# EAGLE board ESP32-S3 4G LTE CAT1 V1.1 (EAGLE 6.1)
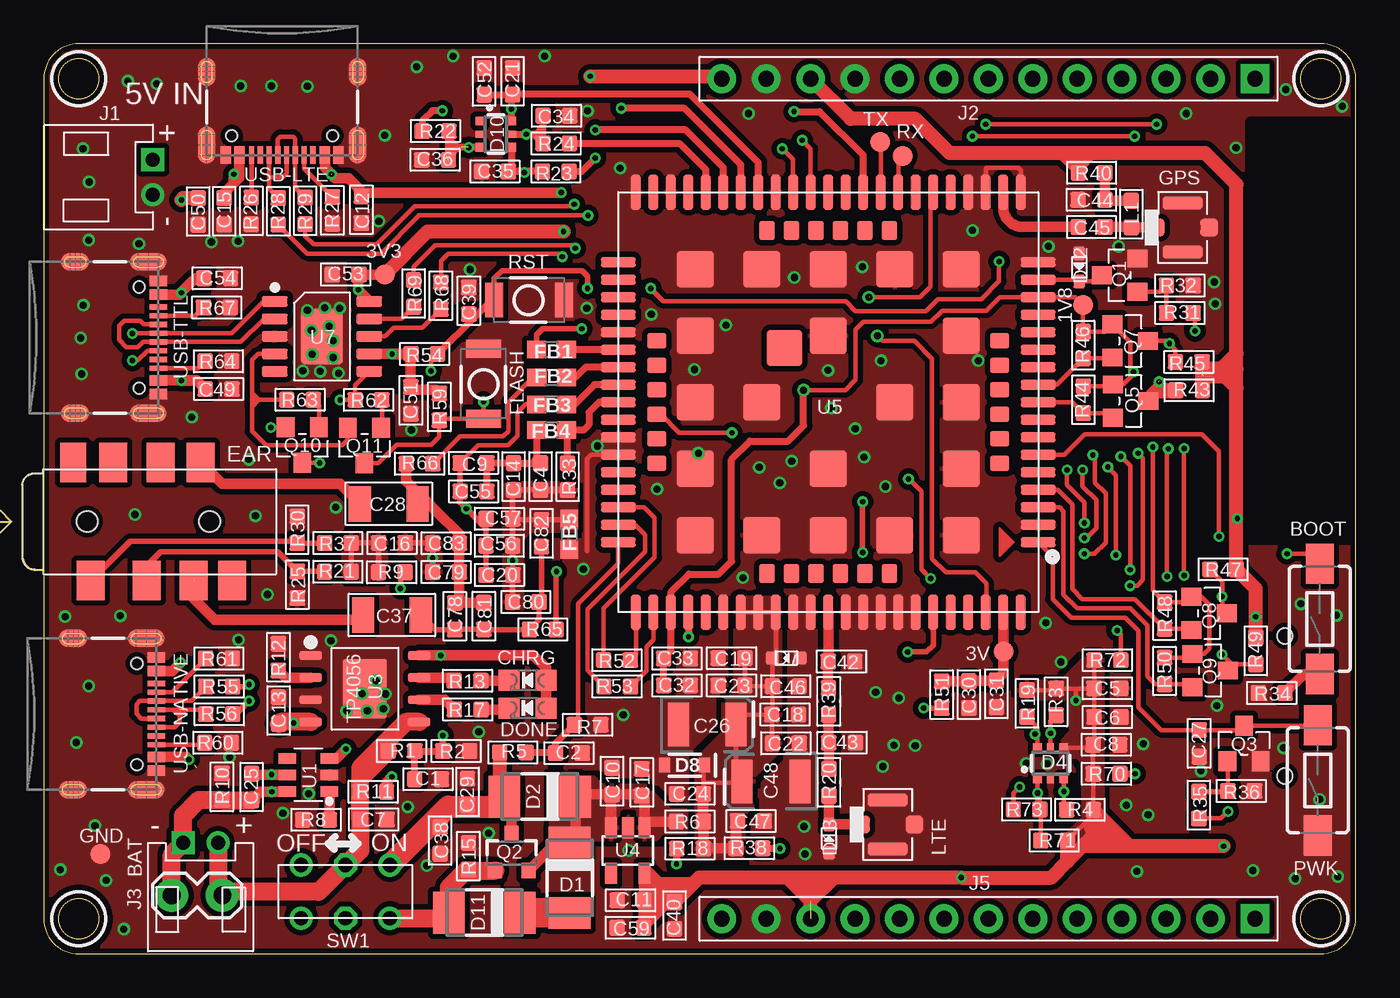
[diagram p2: board, top side]
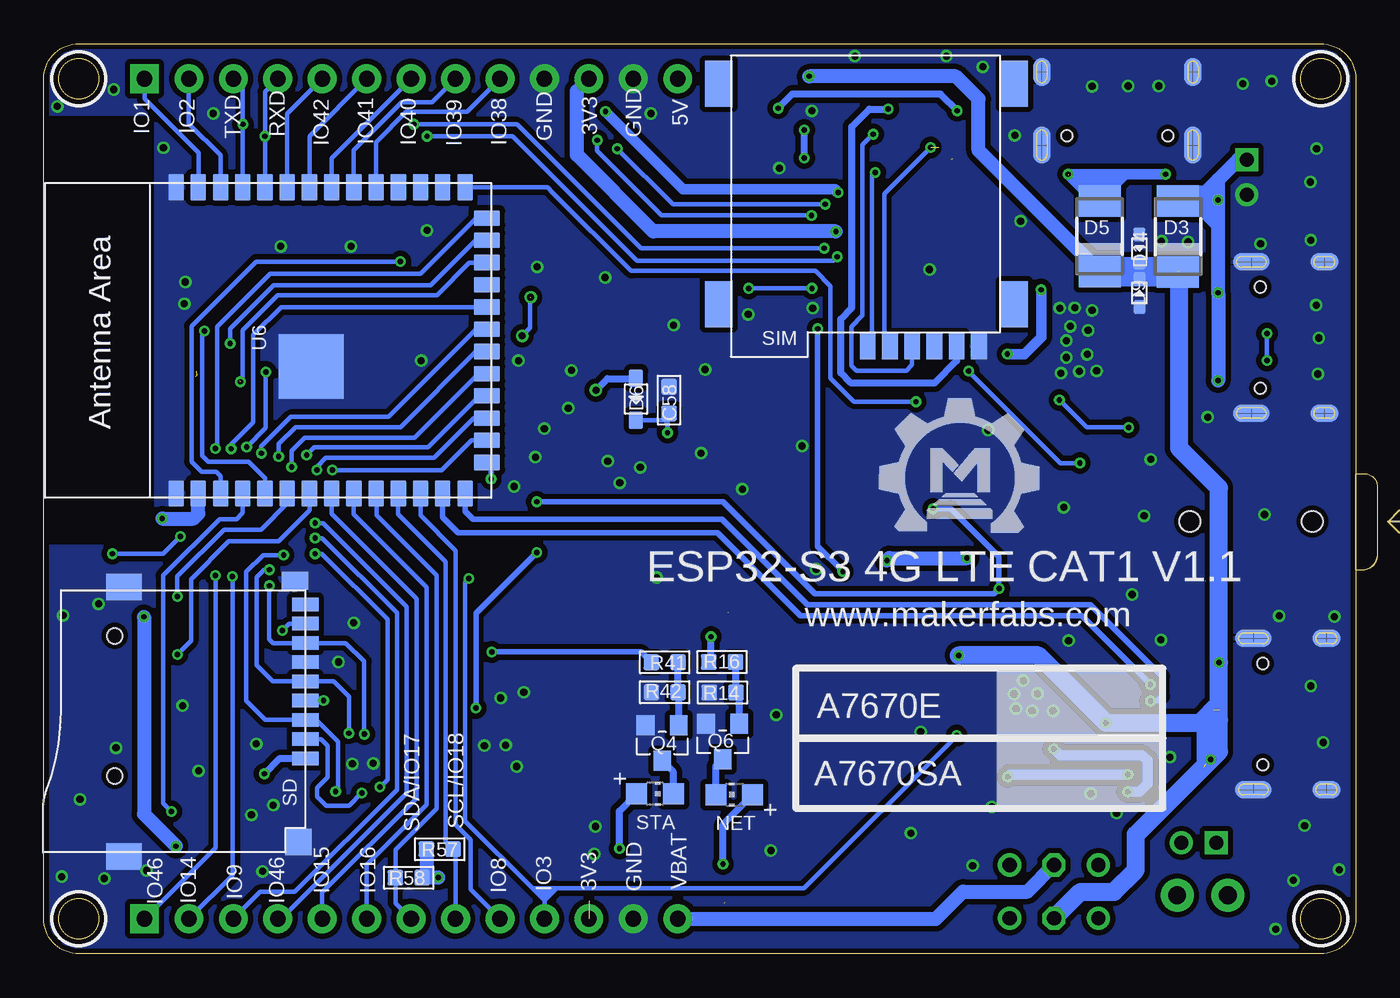
[diagram p3: board, bottom side, seen from below]

Size 75 x 52 mm. Coordinates in mm from the lower left corner, seen from the top.
Outline: 2,0 73,0 arc90 75,2 75,50 arc90 73,52 2,52 arc90 0,50 0,2 arc90 2,0
Outline: circle at 73,2 radius 1.14
Outline: circle at 73,50 radius 1.14
Outline: circle at 2,2 radius 1.14
Outline: circle at 2,50 radius 1.14
Copper layers (1*16): Top 0.035mm / dielectric 1.5mm / Bottom 0.035mm
Design rules: minimum track width 6mil, minimum drill 12mil, track to track 6mil, track to pad 6mil, pad to pad 6mil, via to via 6mil, smd to smd 0mil, copper to edge 10mil, drill to drill 10mil, minimum pad ring 10mil, minimum via ring 6mil, stop-mask expansion 2mil, vias tented up to drill 100mil, thermal gap 0mil
Net classes: 0 default: width 0.203 mm; 2 gnd: width 0.305 mm, drill 0.559 mm, clearance 0.254 mm; 3 usbvcc: width 0.508 mm, drill 0.61 mm, clearance 0.254 mm
tRestrict: area 0.5,0.5 to 3.5,3.5; area 69,23.6 to 75.1,47.5
bRestrict: area 0.5,0.5 to 3.5,3.5; area 69,23.7 to 75.1,47.6

## Footprints (pad centres in the part's own frame; a part is rotated, then mirrored left to right if it is on the bottom)
TP-D45MIL = smd 1.143 x 1.143: T 0,0
PH2.0-2P-90-DIP = drill 0.8 square: 1 0,1 | drill 0.8: 2 0,-1
TACTILE_SWITCH_SMD_6.0X3.5MM = smd 2.3 x 1.6: 1 -3.15,0; 2 3.15,0
0603 = smd 0.889 x 0.889: 1 -0.762,0; 2 0.762,0
DISCRETE_C0603 = smd 0.889 x 0.889: 1 -0.762,0; 2 0.762,0
EIA3528 = smd 1.2 x 2.5: A 1.65,0; C -1.65,0
DISCRETE_C1206 = smd 1.27 x 2.032: 1 -1.651,0; 2 1.651,0
CHIPLED_0805_NOOUTLINE = smd 1.2 x 1.2: A 0,-1.05; C 0,1.05
DO-214AC = smd 1.8 x 2.4: A 2.025,0; C -2.025,0
SOT363 = smd 0.5 x 0.5: 1 -0.75,-0.9; 3 0.75,-0.9; 4 0.75,0.9; 6 -0.75,0.9 | smd 0.4 x 0.5: 2 0,-0.9; 5 0,0.9
SOD323 = smd 1 x 0.8: + -1.2,0; - 1.2,0
DISCRETE_SOD523 = smd 0.762 x 0.7: + -0.8,0; - 0.8,0
SOD-323 = smd 0.63 x 0.83: A 1.15,0; C -1.15,0
AUDIO8P-SMD-3.5-14.5X6.1X4.0MM = smd 1.6 x 2.25: 1 3.9,-3.375; 2 7.1,-3.375; 3 9.8,-3.375; 4 10.2,3.375; 6 5.2,3.375; 7 7.9,3.375; 8 12,-3.375 | smd 1.5 x 2.25: 5 2.9,3.375 | hole 1.2: 3.7,0; 10.7,0
0603' = smd 1.1 x 1: 1 -0.85,0; 2 0.85,0
157SW = smd 1.016 x 1.981: 1 0,0; 2 4,0
4P-U-FL = smd 1.016 x 1.016: D -1.524,0; GND3 1.524,0 | smd 2.286 x 0.762: GND1 0,1.397; GND2 0,-1.397
13P-2.54 = drill 0.889 pad 1.651 square: 1 0,15.24 | drill 0.889 pad 1.651: 2 0,12.7; 3 0,10.16; 4 0,7.62; 5 0,5.08; 6 0,2.54; 7 0,0; 8 0,-2.54; 9 0,-5.08; 10 0,-7.62; 11 0,-10.16; 12 0,-12.7; 13 0,-15.24
1X02_LOCK = drill 1.016 pad 1.88: 1 -0.178,0; 2 2.718,0
L0603 = smd 0.889 x 0.889: 1 -0.762,0; 2 0.762,0
CHIP-LED0805 = smd 1.2 x 1.2: A 0,-1.05; C 0,1.05
SOT23 = smd 1.016 x 1.143: 1 -0.95,-1.016; 2 0.95,-1.016; 3 0,1.016
SOT23-3 = smd 0.8 x 0.9: 1 -0.95,-1; 2 0.95,-1; 3 0,1.1
R0603 = smd 0.889 x 0.889: 1 -0.762,0; 2 0.762,0
DISCRETE_R0603 = smd 0.889 x 0.889: 1 -0.762,0; 2 0.762,0
9P-SMD-W/-RING = smd 1.524 x 0.762: 1 0,4.4; 2 0,3.3; 3 0,2.2; 4 0,1.1; 5 0,0; 6 0,-1.1; 7 0,-2.2; 8 0,-3.3; 9 0,-4.4 | smd 1.524 x 1.016: G1 0.6,-5.746 | smd 2.032 x 1.524: G2 10.373,-5.4; G3 10.373,10 | smd 1.524 x 1.524: G4 0.392,9.181 | hole 0.889: 10.9,-2.6; 10.9,5.4
MICROSIM = smd 1.5 x 0.9: 1 -0.8,2.5; 2 -0.8,5.04; 3 -0.8,7.58; 5 -0.8,1.23; 6 -0.8,3.77; 7 -0.8,6.31 | smd 2.61 x 1.56: P$1 1.6,-0.8; P$2 14.2,-0.8; P$3 14.2,16.1; P$4 1.6,16.1
6P-2CH-2.54-7.6X3.0 = drill 0.813 pad 1.27: CH1A -1.524,2.54; CH1B -1.524,-2.54; CH2A 1.524,2.54; CH2B 1.524,-2.54 | drill 0.813 pad 1.27 octagon: COM1 -1.524,0; COM2 1.524,0
SOT-23-6 = smd 1 x 0.6: 1 -1.2,0.95; 2 -1.2,0; 3 -1.2,-0.95; 4 1.2,-0.95; 5 1.2,0; 6 1.2,0.95
SOP8-1.27P = smd 1.27 x 0.51: 1 -3.1,1.905; 2 -3.1,0.635; 3 -3.1,-0.635; 4 -3.1,-1.905; 5 3.1,-1.905; 6 3.1,-0.635; 7 3.1,0.635; 8 3.1,1.905 | smd 2.5 x 3.4: 9 0,0
SOT23-5 = smd 0.69 x 1.2: 1 -0.95,-1.3; 2 0,-1.3; 3 0.95,-1.3; 4 0.95,1.3; 5 -0.95,1.3
A7670G = smd 2 x 0.6: 1 -12,8; 2 -12,7; 3 -12,6; 4 -12,5; 5 -12,4; 6 -12,3; 7 -12,2; 8 -12,1; 9 -12,0; 10 -12,-1; 11 -12,-2; 12 -12,-3; 13 -12,-4; 14 -12,-5; 15 -12,-6; 16 -12,-7; 17 -12,-8; 35 12,-8; 36 12,-7; 37 12,-6; 38 12,-5; 39 12,-4; 40 12,-3; 41 12,-2; 42 12,-1; 43 12,0; 44 12,1; 45 12,2; 46 12,3; 47 12,4; 48 12,5; 49 12,6; 50 12,7; 51 12,8 | smd 0.6 x 2: 18 -8,-12; 19 -7,-12; 20 -6,-12; 21 -5,-12; 22 -4,-12; 23 -3,-12; 24 -2,-12; 25 -1,-12; 26 0,-12; 27 1,-12; 28 2,-12; 29 3,-12; 30 4,-12; 31 5,-12; 32 6,-12; 33 7,-12; 34 8,-12; 52 8,12; 53 7,12; 54 6,12; 55 5,12; 56 4,12; 57 3,12; 58 2,12; 59 1,12; 60 0,12; 61 -1,12; 62 -2,12; 63 -3,12; 64 -4,12; 65 -5,12; 66 -6,12; 67 -7,12; 68 -8,12; 89 -11,-12; 90 -10,-12; 91 -9,-12; 92 9,-12; 93 10,-12; 94 11,-12; 95 11,12; 96 10,12; 97 9,12; 98 -9,12; 99 -10,12; 100 -11,12 | smd 2.1 x 2.1: 69 -7.6,7.6; 70 -7.6,3.8; 71 -7.6,0; 72 -7.6,-3.8; 73 -7.6,-7.6; 74 -3.8,-7.6; 75 0,-7.6; 76 3.8,-7.6; 77 7.6,-7.6; 78 7.6,-3.8; 79 7.6,0; 80 7.6,3.8; 81 7.6,7.6; 82 3.8,7.6; 83 0,7.6; 84 -3.8,7.6; 85 -3.8,0; 86 0,-3.8; 87 3.8,0; 88 0,3.8 | smd 1.1 x 0.9: 101 -9.8,3.5; 102 -9.8,2.1; 103 -9.8,0.7; 104 -9.8,-0.7; 105 -9.8,-2.1; 106 -9.8,-3.5; 113 9.8,-3.5; 114 9.8,-2.1; 115 9.8,-0.7; 116 9.8,0.7; 117 9.8,2.1; 118 9.8,3.5 | smd 0.9 x 1.1: 107 -3.5,-9.8; 108 -2.1,-9.8; 109 -0.7,-9.8; 110 0.7,-9.8; 111 2.1,-9.8; 112 3.5,-9.8; 119 3.5,9.8; 120 2.1,9.8; 121 0.7,9.8; 122 -0.7,9.8; 123 -2.1,9.8; 124 -3.5,9.8 | smd 2.05 x 2.05: 125 2.5,-3.1
ESP32-­S2-­SOLO = smd 1.5 x 0.9: 1 -8.75,5.26; 2 -8.75,3.99; 3 -8.75,2.72; 4 -8.75,1.45; 5 -8.75,0.18; 6 -8.75,-1.09; 7 -8.75,-2.36; 8 -8.75,-3.63; 9 -8.75,-4.9; 10 -8.75,-6.17; 11 -8.75,-7.44; 12 -8.75,-8.71; 13 -8.75,-9.98; 14 -8.75,-11.25; 27 8.75,-11.25; 28 8.75,-9.98; 29 8.75,-8.71; 30 8.75,-7.44; 31 8.75,-6.17; 32 8.75,-4.9; 33 8.75,-3.63; 34 8.75,-2.36; 35 8.75,-1.09; 36 8.75,0.18; 37 8.75,1.45; 38 8.75,2.72; 39 8.75,3.99; 40 8.75,5.26 | smd 0.9 x 1.5: 15 -6.985,-12.5; 16 -5.715,-12.5; 17 -4.445,-12.5; 18 -3.175,-12.5; 19 -1.905,-12.5; 20 -0.635,-12.5; 21 0.635,-12.5; 22 1.905,-12.5; 23 3.175,-12.5; 24 4.445,-12.5; 25 5.715,-12.5; 26 6.985,-12.5 | smd 3.7 x 3.7: 41 -1.5,-2.46
ESOP-10-EP-150MIL = smd 1.5 x 0.6: 1 -2.7,2; 2 -2.7,1; 3 -2.7,0; 4 -2.7,-1; 5 -2.7,-2; 6 2.7,-2; 7 2.7,-1; 8 2.7,0; 9 2.7,1; 10 2.7,2 | smd 2.4 x 3.2: EP 0,0
USB-C-16P-5 = smd 0.3 x 1: A5 -1.25,-0.34; A6 -0.25,-0.34; A7 0.25,-0.34; A8 1.25,-0.34; B5 1.75,-0.34; B6 0.75,-0.34; B7 -0.75,-0.34; B8 -1.75,-0.34 | smd 0.6 x 1: GND -3.225,-0.34; GND2 3.225,-0.34; VBUS1 -2.45,-0.34; VBUS2 2.45,-0.34 | smd 1 x 2.1: SHLD1 -4.32,-0.915; SHLD2 4.32,-0.915 | smd 1 x 2.1 bottom: SHLD3 -4.32,-0.915; SHLD4 4.32,-0.915 | smd 1 x 1.6: SHLD5 -4.32,-5.095; SHLD8 4.32,-5.095 | smd 1 x 1.6 bottom: SHLD6 -4.32,-5.095; SHLD7 4.32,-5.095 | hole 0.65: -2.89,-1.445; 2.89,-1.445

## Placement (x,y rotation side)
1V8  [TP-D45MIL]  59.41,37.07 180 top
3V  [TP-D45MIL]  54.86,17.26 180 top
3V3  [TP-D45MIL]  19.49,38.81 0 top
BAT  PH2.0-2P-90-DIP  [PH2.0-2P-90-DIP]  8.97,6.33 90 top
BOOT  MOMENTARY-SWITCH-SPST-SMD-6.0X3.5MM  [TACTILE_SWITCH_SMD_6.0X3.5MM]  72.95,19.13 90 top
C1  0.1uF  [0603]  21.96,9.97 0 top
C2  1nF  [0603]  30.02,11.46 0 top
C4  33pF  [0603]  28.4,27.27 90 top
C5  10uF  [DISCRETE_C0603]  60.81,15.16 180 top
C6  10uF  [DISCRETE_C0603]  60.81,13.53 180 top
C7  10uF  [0603]  18.85,7.67 0 top
C8  0.1uF  [0603]  60.74,11.94 0 top
C9  33pF  [0603]  24.57,28.05 180 top
C10  10uF  [0603]  32.48,9.87 270 top
C11  10uF  [0603]  33.55,3.06 0 top
C12  10uF  [0603]  18.16,42.52 270 top
C13  10uF  [0603]  13.43,13.9 90 top
C14  100pF  [0603]  26.86,27.26 90 top
C15  0.1uF  [0603]  10.32,42.43 270 top
C16  10pF  [0603]  19.91,23.48 180 top
C17  10uF  [0603]  34.18,9.8 270 top
C18  10uF  [0603]  42.38,13.67 180 top
C19  1uF  [0603]  39.32,16.88 0 top
C20  10pF  [0603]  26.05,21.65 180 top
C21  0.1uF  [0603]  26.8,49.86 270 top
C22  10pF  [0603]  42.42,12.03 180 top
C23  33pF  [0603]  39.32,15.33 0 top
C24  0.1uF  [0603]  36.94,9.14 0 top
C25  0.1uF  [0603]  11.88,9.53 90 top
C26  100uF  [EIA3528]  37.93,13.1 0 top
C27  NC  [0603]  66.05,12.02 90 top
C28  47uF  [DISCRETE_C1206]  19.73,25.71 180 top
C29  10uF  [0603]  24.22,9.25 90 top
C30  1uF  [0603]  52.89,14.81 90 top
C31  0.1uF  [0603]  54.45,14.85 90 top
C32  1uF  [0603]  36.2,15.34 180 top
C33  0.1uF  [0603]  36.2,16.88 180 top
C34  22pF_NC  [0603]  29.31,47.89 180 top
C35  22pF_NC  [0603]  25.79,44.7 0 top
C36  22pF_NC  [0603]  22.37,45.37 0 top
C37  47uF  [DISCRETE_C1206]  19.9,19.36 180 top
C38  0.1uF  [0603]  22.66,6.47 270 top
C39  0.1uF  [DISCRETE_C0603]  24.3,37.31 90 top
C40  10uF  [DISCRETE_C0603]  36.06,2.18 90 top
C42  NC  [0603]  45.6,16.7 180 top
C43  NC  [0603]  45.64,12.06 180 top
C44  33pF  [0603]  59.89,43.09 180 top
C45  100pF  [0603]  59.9,41.53 180 top
C46  10uF  [0603]  42.42,15.29 180 top
C47  1uF  [0603]  40.43,7.58 180 top
C48  100uF  [EIA3528]  41.57,9.85 180 top
C49  10uF  [DISCRETE_C0603]  10,32.27 180 top
C50  0.1uF  [DISCRETE_C0603]  8.83,42.41 90 top
C51  0.1uF  [DISCRETE_C0603]  20.99,31.62 90 top
C52  33pF  [0603]  25.18,49.85 270 top
C53  0.1uF  [DISCRETE_C0603]  17.25,38.82 0 top
C54  10uF  [DISCRETE_C0603]  9.92,38.6 180 top
C55  100pF  [0603]  24.57,26.42 180 top
C56  33pF  [0603]  26.04,23.32 0 top
C57  100pF  [0603]  26.05,24.86 0 top
C58  33pF  [0603]  39.26,31.64 270 bottom
C59  0.1uF  [DISCRETE_C0603]  33.53,1.49 0 top
C78  33pF  [0603]  23.5,19.29 270 top
C79  33pF  [0603]  22.99,21.82 0 top
C80  33pF  [0603]  27.55,20.1 180 top
C81  100pF  [0603]  25.16,19.3 270 top
C82  100pF  [0603]  28.45,24.03 90 top
C83  100pF  [0603]  23,23.46 0 top
CHRG  RED  [CHIPLED_0805_NOOUTLINE]  27.66,15.63 90 top
D1  S2M  [DO-214AC]  30.07,4.34 270 top
D2  SS34  [DO-214AC]  28.36,8.98 180 top
D3  SS54  [DO-214AC]  10.16,40.98 90 bottom
D4  SMF05C  [SOT363]  57.55,10.88 0 top
D5  SS54  [DO-214AC]  14.63,41 90 bottom
D6  B5819WS  [SOD323]  41.14,31.69 270 bottom
D7  0603ESDA-05N  [DISCRETE_SOD523]  42.45,16.9 180 top
D8  5.1V  [SOD-323]  36.63,10.78 180 top
D9  0603ESDA-05N  [DISCRETE_SOD523]  12.36,37.76 90 bottom
D10  SMF05C  [SOT363]  25.84,46.84 270 top
D11  SS34  [DO-214AC]  25.19,2.35 180 top
D12  0603ESDA-05N  [DISCRETE_SOD523]  59.19,39.22 270 top
D13  0603ESDA-05N  [DISCRETE_SOD523]  44.89,6.59 90 top
D14  0603ESDA-05N  [DISCRETE_SOD523]  12.37,40.3 270 bottom
DONE  GREEN  [CHIPLED_0805_NOOUTLINE]  27.66,14.04 90 top
EAR  AUDIO-JACK-8P-SMD  [AUDIO8P-SMD-3.5-14.5X6.1X4.0MM]  -1.22,24.7 0 top
FB1  120Ω  [0603']  29.02,34.52 180 top
FB2  120Ω  [0603']  29.03,32.93 0 top
FB3  120Ω  [0603']  29.04,31.4 180 top
FB4  120Ω  [0603']  29.03,29.92 180 top
FB5  120Ω  [0603']  30.03,23.96 270 top
FLASH  BUTTON  [157SW]  25.14,34.58 270 top
GND  [TP-D45MIL]  3.23,5.7 0 top
GPS  [4P-U-FL]  65.1,41.5 0 top
J1  PH2.0-2P-90-DIP  [PH2.0-2P-90-DIP]  6.23,44.38 0 top
J2  HEADER-13P  [13P-2.54]  54,50 270 top
J3  [1X02_LOCK]  10.03,3.33 180 top
J5  HEADER-13P  [13P-2.54]  54,2 270 top
L1  68nH  [L0603]  62.17,42.27 270 top
LTE  [4P-U-FL]  48.25,7.38 0 top
NET  NET  [CHIP-LED0805]  35.52,9.1 90 bottom
PWK  MOMENTARY-SWITCH-SPST-SMD-6.0X3.5MM  [TACTILE_SWITCH_SMD_6.0X3.5MM]  72.83,9.91 90 top
Q1  2N7002  [SOT23]  61.5,38.77 90 top
Q2  MOSFET-PCHANNEL  [SOT23-3]  26.75,5.75 0 top
Q3  2N7002  [SOT23]  68.61,12.01 0 top
Q4  BC847C  [SOT23]  39.64,12.05 180 bottom
Q5  2N7002  [SOT23]  62.12,31.58 270 top
Q6  BC847C  [SOT23]  36.19,12.12 180 bottom
Q7  2N7002  [SOT23]  62.11,35.02 270 top
Q8  2N7002  [SOT23]  66.62,19.45 270 top
Q9  2N7002  [SOT23]  66.68,16.18 270 top
Q10  S8050  [SOT23]  14.78,29.06 180 top
Q11  S8050  [SOT23]  18.33,29.05 180 top
R1  100K  [R0603]  20.45,11.59 180 top
R2  100K  [R0603]  23.58,11.59 180 top
R3  NC  [DISCRETE_R0603]  57.87,14.39 90 top
R4  10K  [DISCRETE_R0603]  59.23,8.23 0 top
R5  680K  [R0603]  26.82,11.51 180 top
R6  0R  [R0603]  36.94,7.55 180 top
R7  470K  [R0603]  31.09,13.08 180 top
R8  1K  [R0603]  15.57,7.66 0 top
R9  0R  [R0603]  19.9,21.8 0 top
R10  NC  [R0603]  10.19,9.54 270 top
R11  100R  [R0603]  18.83,9.26 0 top
R12  1.2K  [R0603]  13.42,16.95 90 top
R13  1.2K  [R0603]  24.22,15.61 180 top
R14  47K  [R0603]  36.2,14.93 0 bottom
R15  100k  [R0603]  24.28,5.58 90 top
R16  100R  [R0603]  36.22,16.67 180 bottom
R17  1.2K  [R0603]  24.23,13.95 180 top
R18  1.2K  [R0603]  36.94,6.01 0 top
R19  10K  [DISCRETE_R0603]  56.2,14.31 90 top
R20  0R  [R0603]  44.89,9.79 270 top
R21  NC  [R0603]  16.81,21.83 180 top
R22  22R  [R0603]  22.39,47.01 0 top
R23  22R  [R0603]  29.27,44.7 180 top
R24  22R  [R0603]  29.3,46.31 180 top
R25  0R  [R0603]  14.5,21.08 270 top
R26  5.1K  [R0603]  11.87,42.45 90 top
R27  5.1K  [R0603]  16.5,42.48 90 top
R28  22R  [R0603]  13.41,42.43 90 top
R29  22R  [R0603]  14.95,42.45 90 top
R30  NC  [R0603]  14.49,24.23 90 top
R31  4.7K  [R0603]  64.94,36.61 0 top
R32  47K  [R0603]  64.94,38.19 180 top
R33  2.2K  [R0603]  29.94,27.26 270 top
R34  1K  [R0603]  70.19,14.9 180 top
R35  4.7K  [R0603]  66.03,8.49 270 top
R36  47K  [R0603]  68.45,9.3 180 top
R37  0R  [R0603]  16.81,23.47 180 top
R38  1.2K  [R0603]  40.34,6.03 180 top
R39  0R  [R0603]  44.87,14.42 270 top
R40  0R  [R0603]  59.9,44.62 180 top
R41  100R  [R0603]  39.51,16.66 180 bottom
R42  47K  [R0603]  39.5,14.94 0 bottom
R43  30K  [R0603]  65.47,32.2 0 top
R44  10K  [R0603]  59.42,31.66 90 top
R45  30K  [R0603]  65.46,33.82 0 top
R46  10K  [R0603]  59.42,34.78 90 top
R47  30K  [R0603]  67.42,21.96 0 top
R48  10K  [R0603]  64.07,19.33 90 top
R49  30K  [R0603]  69.28,17.3 90 top
R50  10K  [R0603]  64.07,16.16 90 top
R51  2.2K  [R0603]  51.33,14.8 270 top
R52  1K  [R0603]  32.76,16.78 180 top
R53  1K  [R0603]  32.78,15.27 180 top
R54  10K  [R0603]  21.76,34.28 180 top
R55  33R  [R0603]  10.03,15.27 0 top
R56  33R  [R0603]  10.03,13.69 0 top
R57  10K  [R0603]  52.36,5.98 180 bottom
R58  10K  [R0603]  54.14,4.35 0 bottom
R59  10K  [R0603]  22.61,31.25 90 top
R60  5.1K  [DISCRETE_R0603]  9.96,12.06 180 top
R61  5.1K  [DISCRETE_R0603]  10.02,16.87 180 top
R62  10K  [R0603]  18.57,31.65 180 top
R63  10K  [R0603]  14.65,31.65 180 top
R64  5.1K  [DISCRETE_R0603]  9.99,33.86 180 top
R65  0R  [R0603]  28.53,18.53 0 top
R66  0R  [R0603]  21.48,28.01 0 top
R67  5.1K  [DISCRETE_R0603]  9.89,36.93 180 top
R68  0R  [R0603]  22.7,37.6 270 top
R69  0R  [R0603]  21.14,37.73 270 top
R70  10K  [DISCRETE_R0603]  60.75,10.29 180 top
R71  10K  [DISCRETE_R0603]  57.76,6.47 0 top
R72  10K  [DISCRETE_R0603]  60.81,16.78 180 top
R73  NC  [R0603]  56.18,8.24 0 top
RST  BUTTON  [157SW]  29.74,37.35 180 top
RX  [TP-D45MIL]  49.1,45.6 180 top
SD  [9P-SMD-W/-RING]  60.04,15.57 180 bottom
SIM  MICROSIM  [MICROSIM]  20.32,35.52 90 bottom
STA  NET  [CHIP-LED0805]  40.05,9.14 270 bottom
SW1  [6P-2CH-2.54-7.6X3.0]  17.25,3.55 270 top
TX  [TP-D45MIL]  47.81,46.4 180 top
U1  DW06D  [SOT-23-6]  15.13,10.22 180 top
U3  TP4056  [SOP8-1.27P]  18.36,15.15 0 top
U4  SPX3819  [SOT23-5]  33.39,5.89 180 top
U5  A7670G  [A7670G]  44.84,31.52 180 top
U6  ESP32­S2­SOLO  [ESP32-­S2-­SOLO]  62.17,35.05 90 bottom
U7  CH340K  [ESOP-10-EP-150MIL]  15.9,35.28 0 top
U$1  [MAKERFABS_0.3]  26.76,24.12 0 bottom
USB-LTE  [USB-C-16P-5]  13.63,45.29 180 top
USB-NATIVE  [USB-C-16P-5]  6.77,13.7 270 top
USB-TTL  [USB-C-16P-5]  6.89,35.21 270 top

## Tracks (layer width: path | path; a pad name or v marks a point on that pad's centre or on a via)
1.8V  (via drill 0.3, 0.41)  (1 unrouted)
  Top 0.254: R44.2 60.99,32.42 Q5.1 61.72,32.53 62.13,32.94 | R50.2 65.45,16.92 Q9.1 65.67,17.14 66.34,17.14 66.62,17.42 66.62,19.94 66.16,20.4 Q8.1 65.29,20.09 R48.2 63.4,20.76 v63.4,28.96 | 62.13,32.94 62.13,34.93 Q7.1 60.67,35.55 R46.2 59.41,35.56 1V8.T 58.96,37.52 U5.15 54.66,37.52 53.9,36.75 51.36,36.75 50.72,36.12 46.86,36.12 46.41,35.66 46.41,32.79 45.82,32.21 v43.43,32.21 43.41,32.21 | 62.13,32.94 62.31,33.12 v62.31,33.25 | 35.84,17.28 C33.2 | C32.2
  Top 0.406: U5.97 35.87,19.52 35.87,20.68 36.88,21.69 38.58,21.69 39.32,22.43 39.32,28.25 40.36,29.29 42.55,29.29 43.43,30.18 v43.43,32.21 | 35.84,17.28 35.87,17.31 35.87,19.48 | C32.2 35.43,16.87 C33.2
  Bottom 0.254: v62.31,33.25 62.31,30.05 v63.4,28.96 | 41.17,32.87 D6.+ 41.15,32.94 41.14,32.94 D6.+
  Bottom 0.406: v43.43,32.21 42.77,32.87 41.17,32.87
5V  (via drill 0.3)  (2 unrouted)
  Top 0.254: USB-NATIVE.VBUS2 | v22.7,17.05 | v14.28,13.19 13.48,13.19 C13.1
  Top 0.61: USB-NATIVE.VBUS1 7.33,16.14 7.82,16.64 v7.82,16.65 | USB-NATIVE.VBUS2 8.15,11.24 v8.31,11.09 | U3.8 v22.7,17.05 27.98,17.05 28.7,16.33 CHRG.A DONE.A
  Top 0.813: v31.24,50.14 38.62,50.14 J2.13
  Top 1.016: U3.4 13.54,13.24 C13.1
  Bottom 0.254: v8.31,11.09 8.31,11.07 8.71,10.67
  Bottom 0.305: D14.- D9.-
  Bottom 0.813: D9.- 10.53,38.56 10.11,38.99 | D5.C 21.57,45.91 21.57,48.84 22.86,50.14 v31.24,50.14
  Bottom 1.016: 10.11,38.99 10.11,28.91 7.82,26.62 v7.82,16.65 7.82,13.36 | SW1.COM2 15.74,3.53 13.82,3.53 12.57,4.78 12.57,6.81 8.71,10.67 7.82,11.56 7.82,13.36 | 7.82,13.36 8,13.19 v14.28,13.19 18.15,17.05 v22.7,17.05 | 7.85,14.25 8.91,13.18 8.61,12.88 8.61,10.79
  Bottom 1.676: D5.C 10.18,38.98 D3.C
+3V3  (via drill 0.3)  (4 unrouted)
  Top 0.254: 18.59,34.27 U7.7 | D4.4 59.82,11.78 C8.1 | C8.1 R70.2 R4.2 59.99,7.95 R71.2 | C8.1 60.05,12 C6.2 C5.2 | C5.2 R72.2 | C5.2 59.03,15.15 | 59.03,15.15 R3.2 57.79,15.07 R19.2 | v59,14.48 59,15.13 59.03,15.15 | R47.2 68.22,22.01 v68.22,24.87
  Top 0.406: U7.7 R54.2
  Top 0.61: 3V3.T C53.2 17.98,38.79 v17.98,37.95 18.6,37.33 U7.10 | U7.7 20.94,34.28 20.98,34.24 C51.2 21.14,32.23 22.39,32.23 R59.2 | v19.91,34.27 20.98,34.27 R54.2 | C59.2 34.3,3.04 C11.2 | C11.2 34.31,4.57 U4.5 | C11.2 35.94,3.06 C40.2 | R49.2 69.28,19.23 v69.27,19.25
  Top 0.813: R43.2 66.23,33.05 | 66.23,33.05 66.23,33.8 R45.2 | 68.18,33.43 R47.2 69.28,20.86 R49.2 | 68.18,33.43 68.18,43.96 66.4,45.74 59.84,45.74 | J2.11 46.14,47.7 49.84,47.7 51.79,45.74 58.27,45.74 | 3V3.T 21.95,41.27 v29.72,41.27 | 68.18,33.43 66.61,33.43 66.23,33.05 | 66.32,32.99 67.51,32.99 68.17,32.33 | 66.27,33.27 67.16,33.27 68.17,34.29 | 43.89,4.36 v52.45,4.36 57.59,4.36 58.52,5.28 | 43.89,4.36 37.47,4.36 C40.2 | J5.11 43.84,4.3 43.89,4.36 | 42.52,4.34 43.84,3.02 45.16,4.34 | 34.31,1.73 35.48,2.9 36.09,2.9 36.09,3.02 35.13,3.99 | 34.42,4.7 35.13,3.99 | 35.13,3.99 37.08,3.99 36.68,3.58 34.67,3.58 34.67,2.54 | 58.52,5.28 R71.2 | v67.44,6.15 62.08,6.15 | 62.08,6.15 R4.2 | 62.08,6.15 59.38,6.15 | 59.38,6.15 58.52,5.28 | 59.38,6.15 59.89,6.66 61.09,6.66 60.55,7.19 59.87,7.19 | 59.84,45.74 59.11,45.74 | 59.11,45.74 58.27,45.74 | R40.2 59.14,45.71 59.11,45.74 | 58.27,45.74 59.13,44.88 59.13,45.03 59.84,45.74
  Bottom 0.254: 44.53,49.31 J2.11 | SD.4 59.02,14.47 v59,14.48
  Bottom 0.61: v19.91,34.27 18.95,34.27 17.98,35.23 v17.98,37.95
  Bottom 0.813: 44.53,49.31 44.53,45.64 40.16,41.27 v29.72,41.27 | v68.22,24.87 66.45,24.87 66.17,25.15 U6.2 | R57.2 53.12,4.6 R58.2 v52.45,4.36 | v69.27,19.25 69.27,7.98 v67.44,6.15
  pour Top: 55.73,15.54 58.17,15.54 59.74,17.12 60.53,17.12 60.53,7.77 58.85,6.1 58.24,6.1 58.24,6.55 59.44,7.75 59.44,10.92 59.11,11.25 58.14,11.25 58.14,12.06 58.75,12.67 58.75,14.4 58.55,14.61 55.83,14.61 55.73,14.61
AGND  (via drill 0.3)
  Top 0.305: C16.1 22.22,23.48 C83.1 v22.24,22.62 v22.23,22.61 | C79.1 v22.23,22.61 | v22.23,22.61 | C80.2 26.81,20.12 C20.1 v26.8,22.47 C56.2 26.81,23.33 C57.2 | FB5.1 28.48,24.81 C82.2 26.89,24.79 C57.2 | C57.2 26.81,26.46 C14.1 C4.1
  Top 0.406: C4.1 R33.2
  Bottom 0.813: v26.8,22.47 26.66,22.61 v22.23,22.61
  pour Top: 26.34,19.71 27.36,19.71 27.36,23.72 27.81,24.18 30.43,24.18 30.43,26.87 26.44,26.87 26.34,26.87
  pour Top: 20.29,23.9 22.68,23.9 22.68,21.36 21.74,21.36 21.74,22.3 21.16,22.89 20.32,22.89 20.29,22.89
ANT
  Top 0.61: U5.60 C42.2 44.84,15.21 R39.1
BOOT  (via drill 0.3)
  Top 0.254: U5.6 58.34,28.52 59.51,29.69 66.19,29.69 67.18,28.7 v67.18,23.85 | BOOT.2 72.37,22.86 v71.07,22.86
  Bottom 0.254: v71.07,22.86 68.17,22.86 v67.18,23.85
D+  (via drill 0.3)
  Top 0.254: U7.1 13.19,37.26 12.55,37.26 10.75,35.46 USB-TTL.A6 5.08,35.46 v5.07,35.45 | USB-TTL.B6 5.94,34.46 5.38,33.91 v5.08,33.91
  Bottom 0.254: v5.08,33.91 v5.07,33.91 v5.07,35.45
D-
  Top 0.254: U7.2 12.57,36.27 11.27,34.97 USB-TTL.A7 5.68,34.97 5.38,34.67 4.72,34.67 4.32,35.08 4.32,35.89 4.6,36.17 5.51,36.17 5.71,35.97 USB-TTL.B7
DONE
  Top 0.61: U3.6 22.91,14.52 R17.2
DTR
  Top 0.254: U7.4 12.26,34.28 11.91,33.93 11.91,32.03 | 11.91,31.65 12.29,31.65 | 12.29,31.65 R63.2 | Q11.2 17.38,29.37 17.07,29.06 12.72,29.06 11.91,29.87 11.91,31.27 | 11.91,32.03 11.91,31.65 | 11.91,31.65 11.91,31.27 | 11.91,32.03 12.29,31.65 | 12.29,31.65 11.91,31.27
EAR_N
  Top 0.406: U5.41 30.98,33.52 30.4,32.94 29.89,32.94 FB2.2
EAR_P
  Top 0.406: U5.40 | U5.40 FB1.1
GND  (via drill 0.41)
  Top 0.254: U5.46 31.29,28.52 31.06,28.3 31.06,22.99 | U5.89 55.84,44.77 55.7,44.91 53.87,44.91 53.84,44.88 U5.91
  other vias: 2.17,33.13 16.69,25.51 12.78,20.53 17.3,13.88 18.19,14.87 19.01,15.6 19.54,14.84 19.41,14 18.5,13.88 16.42,17.89 20.81,8.39 21.9,5.04 25.43,6.89 13.67,8.03 15.15,9.15 2.93,7.32 0.95,4.81 3.56,4.2 4.58,1.4 1.86,12.07 2.57,15.3 5.21,25.1 12.1,25.03 11.72,28.25 15.07,36.76 16.06,36.91 16.92,36.89 16.54,35.03 15.3,35.62 16.31,35.85 15.35,34.25 16.54,34.07 15.81,33.28 19.16,41.87 19.49,46.77 15.07,49.56 13.01,49.59 11.26,49.59 6.46,49.72 4.81,49.87 2.24,46.01 2.6,44.1 2.57,40.77 2.27,37.07 5.44,40.57 2.12,35.19 8.47,30.67 24.37,39.1 31.05,36.89 34.73,36.53 39,35.92 37.19,33.38 42.91,38.64 46.39,30 31.66,29.01 30.84,21.98 24.87,12.68 33.13,13.65 14.82,33.31 16.85,33.18 21.01,29.93 28.63,51.29 23.4,51.29 21.32,50.68 31.1,48.17 32.95,44.89 40.29,48.01 33.43,5.9 43.47,7.27 43.52,5.7 47.56,14.94 48.6,11.92 47.96,10.7 35.06,26.55 39.96,21.5 40.9,27.8 45.02,31.17 46.9,28.38 47.86,33.89 44.84,33.33 42.76,28.15 42.07,26.91 48.11,26.7 53.09,41.33 53.42,33.89 48.88,14.61 49.82,11.89 57.36,10.85 57.28,18.91 58.15,16.67 56.17,10.88 61.88,8.49 62.85,12 63.13,7.93 70.87,11.77 72.93,8.82 73.97,4.4 71.53,4.3 69.12,4.76 62.49,4.71 71.86,20 73.9,19.34 67.06,14.18 66.15,10.45 66.91,38.39 66.96,37.14 57.44,40.42 61.45,40.42 71,49.38 74.23,48.42 65.31,48.01 68.16,46.06 46.79,39.25 11.11,40.72 9.58,40.67 1.23,19.26 4.38,19.31 11.13,17.94 10.62,11.23 37.42,28.61
  pour Bottom (isolate 0.305, rank 6): -1.27,-1.27 150,-1.27 150,100 -1.27,100
  pour Top (isolate 0.305, rank 6): -1.27,-1.27 150,-1.27 150,100 -1.27,100
GNSS_PWR_EN  (via drill 0.41)  (1 unrouted)
  Top 0.254: U5.20 50.7,43.37 50.7,38.12 50.09,37.52 v47.17,37.52 | v47.65,35.31 47.93,35.03 49.76,35.03 50.77,34.01 50.77,22.58 51.56,21.79 53.26,21.79 53.87,21.18 53.87,19.53 | 53.87,19.53 53.87,19.51 | U5.98 53.86,19.53 53.87,19.53
  Bottom 0.254: v47.17,37.52 47.19,37.49 | v47.65,35.31 47.19,35.76 47.19,37.52
IO0  (via drill 0.3)
  Top 0.254: Q11.3 19.12,28.04 20.17,29.08 22.15,29.08 22.61,29.55 R59.1 22.7,30.57 FLASH.2 25.14,31.54 v25.15,31.55
  Bottom 0.254: v25.15,31.55 28.68,31.55 30.02,32.89 30.02,38.15 30.89,39.01 41.43,39.01 45.87,43.46 46.2,43.79 46.22,43.8 U6.27
IO1
  Bottom 0.254: J2.1 69.24,48.85 66.16,45.76 U6.39
IO2  (1 unrouted)
  Bottom 0.254: J2.2 66.7,47.42 64.9,45.62 U6.38
IO3  (via drill 0.3)
  Top 0.254: v50.7,21.44 50.16,21.97 50.16,26.42 49.48,27.1 49.4,27.1 v49.43,27.13
  Top 0.406: C1.1 R1.1 R2.2 v22.82,12.46 v22.81,12.47
  Bottom 0.254: v50.7,21.44 50.9,21.23 50.9,7.57 47.07,3.73 | v22.81,12.47 31.55,3.73 45.69,3.73 46.38,3.05 | 47.07,3.73 46.38,3.05 | 46.38,3.05 J5.10 | 45.7,3.73 47.02,3.73 | 47.07,3.73 47.02,3.73 | 47.02,3.73 46.79,3.5 46.25,3.5 | 46,3.5 46.25,3.5 | 46.25,3.5 46.48,3.28
  Bottom 0.305: v49.43,27.13 49.43,27.82 U6.15
IO4  (via drill 0.3)
  Top 0.254: R35.2 67.3,7.73 v67.69,8.13
  Bottom 0.254: U6.4 63.62,25.2 63.98,24.84 64.95,24.84 68.17,21.61 68.17,8.61 v67.69,8.13
IO5  (via drill 0.3)
  Top 0.254: R31.2 65.81,36.5 v65.81,35.59
  Bottom 0.254: U6.5 62.35,27.17 63.3,28.12 65.61,28.12 65.94,28.45 65.94,35.46 v65.81,35.59
IO6  (via drill 0.3)
  Top 0.254: Q8.3 67.36,19.73 v67.36,20.42 67.36,21.26 R47.1
  Bottom 0.254: U6.6 61.08,25.73 62.59,24.23 64.69,24.23 67.36,21.57 v67.36,20.42
IO7  (via drill 0.3)
  Top 0.254: Q9.3 67.69,16.76 v67.36,17.09 67.91,16.54 R49.1
  Bottom 0.254: U6.7 59.79,26.28 59.79,25.35 61.57,23.57 64.41,23.57 66.57,21.41 66.57,17.88 v67.36,17.09
IO8
  Bottom 0.254: U6.12 53.47,25.04 51.46,23.04 51.46,7.37 50.6,6.5 50.6,3.68 J5.9
IO9  (via drill 0.3)
  Top 0.254: v59.49,23.75 59.61,23.75 60.17,24.31 60.17,25.93 59.38,26.72 v59.38,27.64
  Bottom 0.254: U6.17 50.42,30.61 52.68,28.35 58.88,28.35 59.38,27.84 v59.38,27.64 | v59.49,23.75 59.08,23.75 54.81,19.48 54.81,9.37 60.66,3.53 62.64,3.53 J5.3
IO10  (via drill 0.3)
  Top 0.254: v55.78,9.53 55.42,9.17 R73.1 | v59.49,22.86 60.07,22.86 60.71,23.5 60.71,26.31 60.1,26.92 60.1,28.37 v59.97,28.5
  Bottom 0.254: U6.18 50.09,31.88 53.03,28.93 59.54,28.93 v59.97,28.5 | v59.49,22.86 59.11,22.86 55.35,19.1 55.35,9.96 v55.78,9.53
IO11/MOSI  (via drill 0.3)
  Top 0.254: 58.34,10.02 D4.3 58.32,9.96 v58.32,9.27 58.32,8.38 R4.1 | v61.29,22.78 61.29,27.36 v60.83,27.81
  Bottom 0.254: U6.19 50.14,33.15 53.8,29.49 60.1,29.49 60.83,28.75 v60.83,27.81 | v58.32,9.27 58.17,9.42 58.17,12.12 59.42,13.37 SD.3 62.33,13.36 63.42,14.45 63.42,21.82 62.46,22.78 v61.29,22.78
IO12/SCLK  (via drill 0.3)
  Top 0.254: D4.5 v57.55,12.6 57.55,13.31 R3.1 | v61.57,28.42 62.1,27.89 v62.1,21.95
  Bottom 0.254: U6.20 50.29,34.42 54.61,30.1 60.6,30.1 61.57,29.13 v61.57,28.42 | v57.55,12.6 57.55,14.68 58.44,15.57 SD.5 61.92,15.57 62.84,16.48 62.84,21.51 62.41,21.95 v62.1,21.95
IO13/MISO  (via drill 0.3)
  Top 0.254: D4.6 56.8,12.55 | 56.8,12.55 56.8,12.94 R19.1 | v56.68,12.55 56.8,12.55 | v62.56,28.6 62.84,28.32 62.84,21.36 62.51,21.03 v62.1,21.03
  Bottom 0.254: U6.21 50.29,35.69 55.3,30.68 60.88,30.68 62.56,29.01 v62.56,28.6 | v62.1,21.03 62.1,17.98 61.87,17.75 60.05,17.75 SD.7 60.03,17.75 57.73,17.75 56.68,16.7 v56.68,12.55
IO14  (via drill 0.3)
  Top 0.254: v64.29,28.85 64.21,28.78 v64.21,21.57
  Bottom 0.254: J5.2 64.21,4.49 v64.21,21.57 | U6.22 61.44,36.96 63.02,35.38 63.02,30.38 64.29,29.11 v64.29,28.85
IO15
  Bottom 0.254: U6.8 58.55,25.15 53.7,20.3 53.7,8.89 59.08,3.51 J5.5
IO16
  Bottom 0.254: U6.9 57.28,25.12 53.11,20.95 53.11,8.51 56.54,5.08 J5.6
IO17/I2C_SDA
  Bottom 0.254: U6.10 55.98,26.28 55.98,25.04 52.55,21.61 52.55,8.28 54.9,5.93 54.9,4.85 R58.1 54.9,2.9 J5.7
IO18/I2C_SCL
  Bottom 0.254: U6.11 54.74,25.12 52.02,22.4 52.02,6.4 R57.1 51.46,5.84 J5.8
IO19  (via drill 0.3)
  Top 0.305: R55.2 11.62,15.27 v11.75,15.39
  Bottom 0.305: v11.75,15.39 15.66,19.3 31.75,19.3 36.5,24.05 51.31,24.05 52.2,24.94 U6.13
IO20  (via drill 0.3)
  Top 0.254: R56.2
  Top 0.305: R56.2 10.98,13.69 v11.74,14.45
  Bottom 0.305: v11.74,14.45 11.33,14.45 11.07,14.71 11.07,15.85 15.16,19.94 31.34,19.94 36.22,24.82 50.44,24.82 50.93,25.3 U6.14
IO38
  Bottom 0.254: J2.9 50.81,48.11 54.28,48.11 56,46.38 U6.31
IO39
  Bottom 0.254: J2.8 52.79,48.67 54.53,48.67 57.27,45.93 U6.32
IO40
  Bottom 0.254: J2.7 58.54,45.46 U6.33
IO41
  Bottom 0.254: J2.6 59.81,46.73 U6.34
IO42
  Bottom 0.254: J2.5 61.08,48 U6.35
IO45  (via drill 0.3)
  Top 0.254: v65.18,28.88 v65.18,21.61
  Bottom 0.254: J5.1 65.18,6.06 v65.18,21.61 | U6.26 50.29,42.04 53.47,38.86 62.05,38.86 65.08,35.84 65.08,28.98 v65.18,28.88
IO46  (via drill 0.3)
  Top 0.254: v58.5,27.64 58.5,26.8 59.49,25.81 v59.49,24.61
  Bottom 0.254: U6.16 50.55,29.34 52.25,27.64 v58.5,27.64 | v59.49,24.61 59.03,24.61 54.25,19.84 54.25,9.17 61.42,2 J5.4
IO47  (via drill 0.3)  (1 unrouted)
  Top 0.254: 64.72,32.19 R43.1 63.26,32.2 | Q5.3 63.13,32.07 63.17,32.11 63.26,32.2 | 63.26,32.2 v63.75,32.69
  Top 0.406: 63.78,32.74 64.08,32.44 | 64.08,32.44 64.92,32.44 | 64.08,32.44 63.6,32.44 63.12,31.95 | 63.04,31.88 63.12,31.95 | 63.12,31.95 64.75,31.95
  Bottom 0.254: U6.24 50.67,39.5 52.53,37.64 61.62,37.64 63.63,35.64 63.63,32.82 v63.75,32.69
IO48  (via drill 0.3)
  Top 0.254: 64.75,33.87 R45.1 64.69,34.52 v64.34,34.87 64.2,35.02 Q7.3
  Bottom 0.254: v64.34,34.87 64.34,35.71 61.85,38.2 52.88,38.2 50.32,40.77 U6.25
ISET
  Top 0.61: U3.2 13.82,15.79 R12.1
LTE_DTR
  Top 0.254: U5.3 58.08,25.52 58.29,25.3 58.29,20.52 59.08,19.74 62.13,19.74 63.09,18.77 63.09,15.85 63.55,15.39 R50.1 65.5,15.4 Q9.2
LTE_RI
  Top 0.254: U5.4 57.96,26.52 58.8,25.68 58.8,20.85 59.38,20.27 62.37,20.27 R48.1 65.54,18.56 Q8.2
LTE_RXD
  Top 0.254: U5.10 57.92,32.52 R46.1 61.05,34.02 Q7.2
LTE_TXD
  Top 0.254: Q5.2 60.84,30.89 R44.1 58.8,31.52 U5.9
MF_GNSS_RXD
  Top 0.254: R52.2 32,19.73 34.92,22.66 34.92,24.92 34.31,25.53 32.85,25.53 U5.49
MF_GNSS_TXD
  Top 0.254: R53.2 31.09,16.2 31.09,19.68 34.37,22.96 34.37,23.95 33.8,24.52 U5.50
MIC_N
  Top 0.406: U5.43 31.75,31.52 31.17,30.94 31.17,30.23 30.86,29.92 FB4.1 29.94,29.86 R33.1
MIC_P
  Top 0.406: U5.42 31.48,32.52 30.36,31.4 FB3.1
N$1
  Bottom 0.406: NET.C 36.57,10.71 Q6.3
N$2
  Top 0.61: R13.1 26.59,15.61 CHRG.C
N$3
  Top 0.61: R20.2 D13.- LTE.D
N$4
  Bottom 0.406: Q4.1 38.7,14.89 R42.2 R41.1
N$5
  Bottom 0.406: Q6.1 35.24,14.73 R14.2 35.43,16.64 R16.1
N$6  (via drill 0.3)
  Top 0.406: R18.1 v36.18,5.14 v36.17,5.13
  Bottom 0.406: v36.17,5.13 36.17,7.4 NET.A
N$7  (via drill 0.3)
  Top 0.406: R70.1 v62.38,10.29
  Bottom 0.406: v62.38,10.29 61.5,11.17 SD.1
N$8
  Top 0.61: BOOT.1 72.04,15.98 R34.1
N$9  (via drill 0.3)
  Top 0.61: C25.2 11.93,10.24 v13.03,10.24 13.05,10.21 U1.5 | R11.2 19.59,9.81 v19.9,10.11
  Bottom 0.61: v13.03,10.24 19.77,10.24 v19.9,10.11
N$10
  Top 0.61: U1.1 R8.2
N$11
  Top 0.61: R17.1 26.52,13.95 DONE.C
N$12
  Top 0.61: U3.7 23.28,15.79 R13.2
N$13
  Top 1.676: D11.C 30.03,2.35 D1.A
N$14
  Top 0.305: R21.1 R37.1 C16.2 19.13,23.46 R9.1
  pour Top: 17.14,23.93 19.58,23.93 19.58,21.39 17.14,21.39
N$15  (via drill 0.3)
  Top 0.254: C9.2 24.82,29.06 26.54,29.06 27.08,29.59 27.08,30.94 27.53,31.39 FB3.2
  Top 0.305: C9.2 C55.2 23.81,25.78 v24.16,25.43 25.28,24.31 C56.1 | R9.2 20.39,21.54 v20.39,20.86 | C56.1 C57.1 | C56.1 C20.2 | R51.2 v50.3,14.04 v50.29,14.05 | v46.81,22.94 v46.81,25.83
  Bottom 0.305: v24.16,25.43 23.14,25.43 20.39,22.68 v20.39,20.86 20.68,20.57 30.91,20.57 36.17,25.83 v46.81,25.83 | v50.29,14.05 50.29,19.46 v46.81,22.94
N$16
  Top 0.305: EAR.2 5.88,22.16 6.68,22.96 13.38,22.96 R25.1 16.04,21.84 R21.2
N$17
  Top 0.254: R66.2 23.8,29.57 26.26,29.57 26.57,29.87 26.57,31.52 27.98,32.93 FB2.1
N$18  (via drill 0.3)
  Top 0.254: R72.1 61.57,18.26 v61.37,18.47
  Bottom 0.254: SD.8 60.06,18.85 60.98,18.85 v61.37,18.47
N$19  (via drill 0.3)
  Top 0.254: U5.116 35.27,30.82 36.32,29.77 v39.34,29.77
  Bottom 0.254: v39.34,29.77 39.34,30.35 | 39.34,30.35 39.34,30.79 C58.2 | D6.- 39.48,30.49 39.34,30.35
N$20
  Top 0.305: EAR.1 4.93,23.57 14.38,23.57 R30.1 R37.2
N$21
  Top 0.61: C81.1 24.03,20.06 | 24.03,20.06 C78.1 | 24.03,20.06 23.75,20.33 C79.2 C83.2 23.76,23.96 22.35,25.38 22.02,25.7 | 22.02,25.7 C28.1 | R66.1 20.72,27.01 22.02,25.7
N$22  (via drill 0.3)
  Top 0.406: U5.31 39.84,45.09 36.63,48.31 v33.03,48.31 v33.02,48.32 | v22.78,48.17 22.22,48.17 21.64,47.6 R22.1
  Bottom 0.406: v33.02,48.32 32.22,49.12 23.73,49.12 v22.78,48.17
N$23  (via drill 0.3)
  Top 0.406: U5.32 38.84,44.93 36.69,47.08 v31.53,47.08 | R23.1 30.76,44.7 v31.52,45.46
  Bottom 0.406: v31.52,45.46 v31.52,47.08 v31.53,47.08
N$24
  Top 0.406: U5.33 37.84,44.81 36.37,46.28 30.08,46.28 R24.1
N$25
  Top 0.406: C55.1 C9.1 26.84,28.05 C14.2 27.91,28.03 | 27.91,28.03 C4.2 | FB4.2 28.18,28.29 27.91,28.03
N$27
  Top 0.254: USB-LTE.A5 14.88,44.86 R27.2
N$28
  Top 0.254: USB-LTE.B5 11.88,43.23 R26.2
N$29  (via drill 0.3)
  Top 0.406: R38.1 v42.08,6.03 v42.09,6.02
  Bottom 0.406: v42.09,6.02 42.09,8.15 STA.A
N$30
  Bottom 0.406: STA.C 39.01,10.39 Q4.3
N$31
  Top 0.305: C37.1 22.39,18.53 C78.2 C81.2 R65.1 28.32,19.08 C80.1 28.45,20.24 C82.1
N$32
  Top 0.254: USB-LTE.B6 12.88,44.36 | 12.88,44.36 12.88,43.72 R28.2 | USB-LTE.A6 13.88,44.59 13.67,44.38 12.9,44.38 12.88,44.36
N$33
  Top 0.254: R29.2 14.38,43.78 USB-LTE.B7 14.38,46.56 14.26,46.69 13.52,46.69 13.38,46.55 USB-LTE.A7
N$34
  Top 0.254: R31.1 R32.2 63.81,37.82 Q1.1
N$35
  Top 0.61: U5.90 54.84,42.67 arc90 55.98,41.53 C45.2
N$36
  Top 0.61: C28.2 16.94,26.85 11.73,26.85 10.22,26.85 10.2,26.85 EAR.4
N$37
  Top 0.254: U5.95 33.84,17.1 R52.1
N$38
  Top 0.254: U5.96 34.84,17.94 34.45,17.55 34.45,16.18 R53.1
N$41
  Top 0.254: USB-NATIVE.A5 7.33,14.95 R61.2
N$42
  Top 0.254: USB-NATIVE.B5 9.08,11.95 R60.2
N$43
  Top 0.254: R36.2 67.69,10.97 Q3.1
  Top 0.305: R35.1 67.64,9.26 R36.2
N$44
  Top 0.254: Q10.1 15.73,31.34 R63.1
N$45
  Top 0.254: Q11.1 19.33,30.12 R62.1
N$46
  Top 0.254: USB-TTL.A5 8.66,36.46 R67.2
N$47
  Top 0.254: USB-TTL.B5 8.82,33.46 R64.2
N$48
  Top 0.254: U7.9 20.45,36.28 R69.2
N$49
  Top 0.254: U7.8 19.52,35.28 20,35.76 21.62,35.76 R68.2
N$59  (via drill 0.3)
  Top 0.305: R65.2 29.29,21.82 v29.31,21.84 | FB1.2 28.17,35.36 28.52,35.71 v30.76,35.71
  Bottom 0.305: v30.76,35.71 30.76,23.29 v29.31,21.84
N$64  (1 unrouted)
  Top 0.61: 8.61,21.31 8.61,20.24 9.78,19.07 17.97,19.07 C37.2
N$72
  Top 0.61: R39.2 44.87,12.07 C43.2 44.87,10.57 R20.1
N$73
  Top 0.61: R40.1 C44.1 60.71,43.03 L1.1
N$76
  Top 0.61: C45.1 62.14,41.53 L1.2 GPS.D
NETLED  (via drill 0.3)
  Top 0.406: U5.52 36.85,19.5 v36.85,18.11
  Bottom 0.406: R16.2 36.85,16.8 v36.85,18.11
NRST
  Top 0.254: U5.16 59.09,38.52 D12.- 60.12,38.42 Q1.3
PWRKEY
  Top 0.254: U5.1 57.68,22.68 57.68,20.27 58.75,19.2 61.82,19.2 62.56,18.47 62.56,14.1 63.88,12.78 C27.2 68.36,12.78 Q3.3 72.8,13.03 PWK.2
RESET  (via drill 0.3)
  Top 0.254: Q10.3 v15.77,28.04 | v34.7,38.02 34.75,37.97 | v54.61,39.55 54.61,38.43 53.59,37.41 51.1,37.41 50.42,36.73 46.41,36.73 45.85,37.29 35.46,37.29 35.43,37.29 | R54.1 22.14,33.89 v22.14,33.29 | 34.75,37.97 35.2,37.52 35.43,37.29 | 34.75,37.97 34.72,37.97 35.41,37.29 35.43,37.29
  Top 0.305: RST.2 25.74,38.59 26.19,39.04 30.76,39.04 31.09,38.71 v31.09,38.02
  Top 0.406: R54.1 24.61,36.37 | 24.61,36.37 25.59,37.35 RST.2 | C39.1 24.48,36.37 24.61,36.37
  Bottom 0.254: U6.3 64.89,27.28 65.15,27.53 65.96,27.53 66.55,28.12 66.55,35.87 62.87,39.55 v54.61,39.55 | v31.09,38.02 v34.7,38.02 | v15.77,28.04 16.88,28.04 v22.14,33.29
RTS  (via drill 0.3)
  Top 0.254: U7.6 17.81,32.48 R62.2 v16.94,31.65 | Q10.2 v12.98,30.08 v12.98,30.07
  Bottom 0.254: v12.98,30.07 15.37,30.07 v16.94,31.65
RXD/IO44  (via drill 0.3)
  Top 0.254: v53.09,46.71 v62.35,46.71 | R68.1 22.7,39.59 23.11,40.01 29.46,40.01 v29.64,39.83
  Bottom 0.254: J2.4 62.35,49.27 v62.35,46.71 U6.36 | v53.09,46.71 48.21,46.71 41.1,39.6 29.87,39.6 v29.64,39.83
SD_CS  (via drill 0.3)
  Top 0.254: D4.1 56.8,8.38 R73.2 | R71.1 56.99,8.19 R73.2 | R73.2 56.95,9.07 v56.82,9.2
  Bottom 0.254: SD.2 59.15,12.27 58.78,11.89 58.78,10.08 59.36,9.5 59.36,8.97 58.85,8.46 57.56,8.46 v56.82,9.2
SIM_CLK  (via drill 0.3)
  Top 0.406: D10.4 26.74,44.89 C35.2 | C35.2 27.42,44.7 v27.48,44.64 | R23.2 C35.2
  Bottom 0.254: SIM.3 27.66,34.96 27.66,44.46 v27.48,44.64
SIM_DATA  (via drill 0.3)  (2 unrouted)
  Top 0.406: C36.2 23.14,46.13 | 23.14,46.13 23.14,46.99 R22.2 | D10.3 23.17,46.09 23.14,46.13 | 23.14,46.58 23.65,46.08 23.7,46.08 | 23.82,46.08 23.7,46.08 | 23.7,46.08 23.06,45.44
  Bottom 0.254: SIM.7 26.95,35.04 26.95,43.43 v24.3,46.08
SIM_RST  (via drill 0.3)  (1 unrouted)
  Top 0.406: D10.5 v27.58,46.84 v27.59,46.83 28.01,46.83 R24.2 28.53,47.88 C34.2 | v27.58,46.84 28.14,46.84 28.52,47.22
  Bottom 0.254: SIM.2 25.36,33.64 25.68,33.33 28.55,33.33 28.83,33.6 28.83,35.84 28.19,36.47 28.19,46.23 v27.59,46.83
SIM_VDD  (via drill 0.3)
  Top 0.406: C21.2 26.74,49.03 D10.6 26.74,48.24 v26.72,48.26 | C52.2 C21.2 | U5.30 40.84,45.21 36.93,49.12 26.84,49.12 C21.2
  Bottom 0.406: SIM.1 22.82,33.87 24.08,32.61 28.85,32.61 29.44,33.2 29.44,36.27 28.8,36.91 28.8,47.27 27.81,48.26 v26.73,48.26 v26.72,48.26
STATUS  (via drill 0.3)
  Top 0.305: U5.66 50.84,17.62 50.47,17.25 v49.38,17.25
  Bottom 0.305: v49.38,17.25 40.86,17.25 R41.2
TXD/IO43  (via drill 0.3)
  Top 0.254: v53.85,47.4 v63.62,47.4 | R69.1 21.14,39.25 22.38,40.49 30.2,40.49 v30.38,40.31
  Bottom 0.254: J2.3 63.62,49.46 v63.62,47.4 U6.37 | v53.85,47.4 47.95,47.4 40.87,40.31 v30.38,40.31
UART_LOG_RX
  Top 0.254: U5.22 48.84,45.34 RX.T
UART_LOG_TX
  Top 0.254: U5.23 47.84,46.36 TX.T
USB_D+  (1 unrouted)
  Top 0.254: USB-NATIVE.A6 7.78,13.95 | 7.78,13.95 9.02,13.95 R56.1 | USB-NATIVE.B6 7.49,12.95 7.78,13.24 7.78,13.95 | 7.44,13.92 7.77,13.59 8.13,13.95 8.18,13.95
USB_D-
  Top 0.254: R55.1 8.45,14.45 USB-NATIVE.B7 5.5,14.45 5.3,14.25 5.3,13.71 5.58,13.44 USB-NATIVE.A7
USB_DN  (via drill 0.3)
  Top 0.254: U5.28 42.82,43.53 42.82,45.39 v42.22,46 | v30.33,42.82 30.23,42.72 21.21,42.72 19.02,40.54 15.42,40.54 14.95,41.01 R29.1
  Bottom 0.254: v30.33,42.82 38.63,42.82 38.71,42.82 39.04,42.82 v42.22,46
USB_DP  (via drill 0.3)
  Top 0.254: R28.1 15.07,40.01 19.28,40.01 21.44,42.16 21.44,42.19 v31.11,42.19 | U5.27 43.84,46 v43.36,46.48
  Bottom 0.254: v31.11,42.19 39.67,42.19 43.36,45.87 v43.36,46.48
V_BATT
  Top 0.254: D8.C 37.7,10.7 37.7,9.78 | 37.7,9.78 C24.2 | 37.7,9.78 39.85,9.78 C48.A 39.58,10.18 C26.A 40.14,13.67 C18.2 | C22.2 41.62,12.07 C18.2 | C18.2 41.65,13.7 C46.2 | C46.2 D7.- 41.84,17.1 U5.57 U5.56 U5.55 | C46.2 40.12,15.29 C23.2 C19.2
  Top 0.61: C24.2 R6.1 R18.2 37.72,6.03 R38.2 39.58,7.5 C47.2 | C24.2
  pour Top: 39.55,20.35 39.55,14.94 38.86,14.25 38.86,12.62 37.31,11.07 37.31,5.49 40.01,5.49 40.01,7.98 40.56,8.53 40.56,10.13 42.09,11.66 42.09,20.32 42.09,20.35
VBAT+
  Top 0.61: R11.1 18.07,8.73 18.09,8.71
  Top 1.016: BAT.2 9.97,3.58 J3.1 10.41,3.53 15.71,3.53 SW1.COM1 18.09,5.91 C7.1 18.09,8.71 18.09,9.99 | 18.09,9.99 R1.2 | U3.5 20.71,13.24 18.09,10.62 18.09,9.99
  Bottom 0.813: J5.13 24.01,2 22.45,3.56 18.77,3.56 SW1.COM1
VBAT-  (via drill 0.3)
  Top 0.61: U1.3 16.73,11.16 v17.27,11.7 | v13.04,9.26 v13.05,9.27 U1.6 12.38,9.27 C25.1
  Top 1.016: J3.2 7.32,5.68 BAT.1 7.97,7.89 8.87,8.79 10.18,8.79 R10.2 11.87,8.78 C25.1
  Bottom 0.61: v13.04,9.26 12.38,9.26 11.89,9.75 11.89,11.02 12.22,11.35 16.92,11.35 v17.27,11.7
VBAT_ADC
  Top 0.254: R7.2 30.56,13.31 30.56,19.99 32.84,22.28 U5.51
  Top 0.406: R5.1 29.22,11.51 C2.1 29.26,12.02 R7.2
VBAT_IN
  Top 0.254: C38.1 22.66,7.31 22.34,7.63 | C29.1 23.2,8.48 23.08,8.37 | 26.75,8.56 26.6,8.41 26.29,8.41 26.26,8.41
  Top 0.61: Q2.3 26.75,8.56 D2.A
  Top 0.813: R5.2 26.05,9.26 D2.A
  Top 1.27: SW1.CH1A 22.34,7.63 23.08,8.37 23.12,8.41 26.21,8.41 26.26,8.41
VBUS  (via drill 0.3)
  Top 0.61: USB-TTL.VBUS1 7.74,37.66 7.87,37.79 | C54.2 8.68,38.6 8.41,38.33 7.87,37.79 | USB-TTL.VBUS2 8.38,32.76 | 8.38,32.76 8.74,32.76 C49.2 | v7.87,32.75 8.38,32.75 8.38,32.76 | v7.87,37.77 7.87,37.79
  Top 0.813: C50.2 7.96,43.18 v7.87,43.08
  Bottom 0.813: v7.87,43.08 v7.87,37.77 v7.87,32.75 | 7.87,44.23 6.72,45.38 J1.1 | D3.A 7.93,43.01 v7.87,43.08 | v7.87,43.08 7.87,44.23 | 7.87,44.23 8.61,43.48 9.45,43.48 9.45,42.52 8.74,42.52 8,41.78
VDD
  Top 0.61: U5.99 54.84,17.28 3V.T 54.86,16.02 C31.2 52.93,15.61 C30.2 R51.1
VIN
  Top 0.61: U4.3 32.44,9.06 C10.2 | U4.1 34.34,7.72 | 34.34,7.72 34.34,8.88 C17.2 34.11,9.1 C10.2 | R6.2 34.51,7.55 34.34,7.72 | Q2.2 29.32,6.37 D1.C 30.39,6.69 D2.C 30.51,9.1 C10.2
  pour Top: 34.01,6.55 34.01,8.18 33.81,8.38 33.02,8.38 32.82,8.18 32.82,6.55 29.01,6.55 29.01,10.13 31.34,10.13 31.88,9.6 34.37,9.6 35.76,8.2 36.7,8.2 36.7,6.91 35.36,6.91 35.03,6.58 35,6.55
VSYS
  Top 0.305: R15.1 24,4.53 23.91,4.53
  Top 1.016: SW1.CH2A 22.84,2.02 D11.A 23.17,3.79 23.91,4.53 24.13,4.75 Q2.1
VUSB  (via drill 0.3)  (1 unrouted)
  Top 0.254: C12.1
  Top 0.406: v42.89,48.12 44.35,48.12 46.84,45.63 U5.24
  Top 0.61: USB-LTE.VBUS2 11.18,44.35 10.87,44.04 | C15.1 10.32,43.49 10.87,44.04 | v10.87,44.55 10.87,44.04 | USB-LTE.VBUS1 16.08,44.96 16.08,44.91 v16.45,44.55 16.67,44.32 17.42,44.32 18.16,43.59 C12.1 18.36,43.48 29.58,43.48 v29.59,43.5
  Bottom 0.61: v42.89,48.12 38.45,43.69 29.78,43.69 v29.59,43.5 | v10.87,44.55 14.66,44.55 | 14.66,44.55 v16.45,44.55 | D5.A 14.63,44.52 14.66,44.55 | 14.12,43.23 14.12,43.59 13.28,44.42 16.33,44.42 | 16.33,44.42 16.43,44.53 | 16.33,44.42 15.57,43.66 | 15.42,43.51 15.57,43.66 | 15.57,43.66 15.57,44.04 13.92,44.04

## Text on the board
tPlace: 5V IN | + | - | - | + | OFF | ON
bPlace: 5V | GND | 3V3 | RXD | TXD | IO2 | IO1 | GND | IO38 | IO39 | IO40 | IO41 | IO42 | ESP32-S3 4G LTE CAT1 V1.1 | www.makerfabs.com | A7670E | A7670SA | SCL/IO18 | SDA/IO17 | VBAT | GND | 3V3 | IO3 | IO8 | IO16 | IO15 | IO46 | IO9 | IO14 | IO46